# EAGLE design beacon_board (EAGLE 6.5.0)
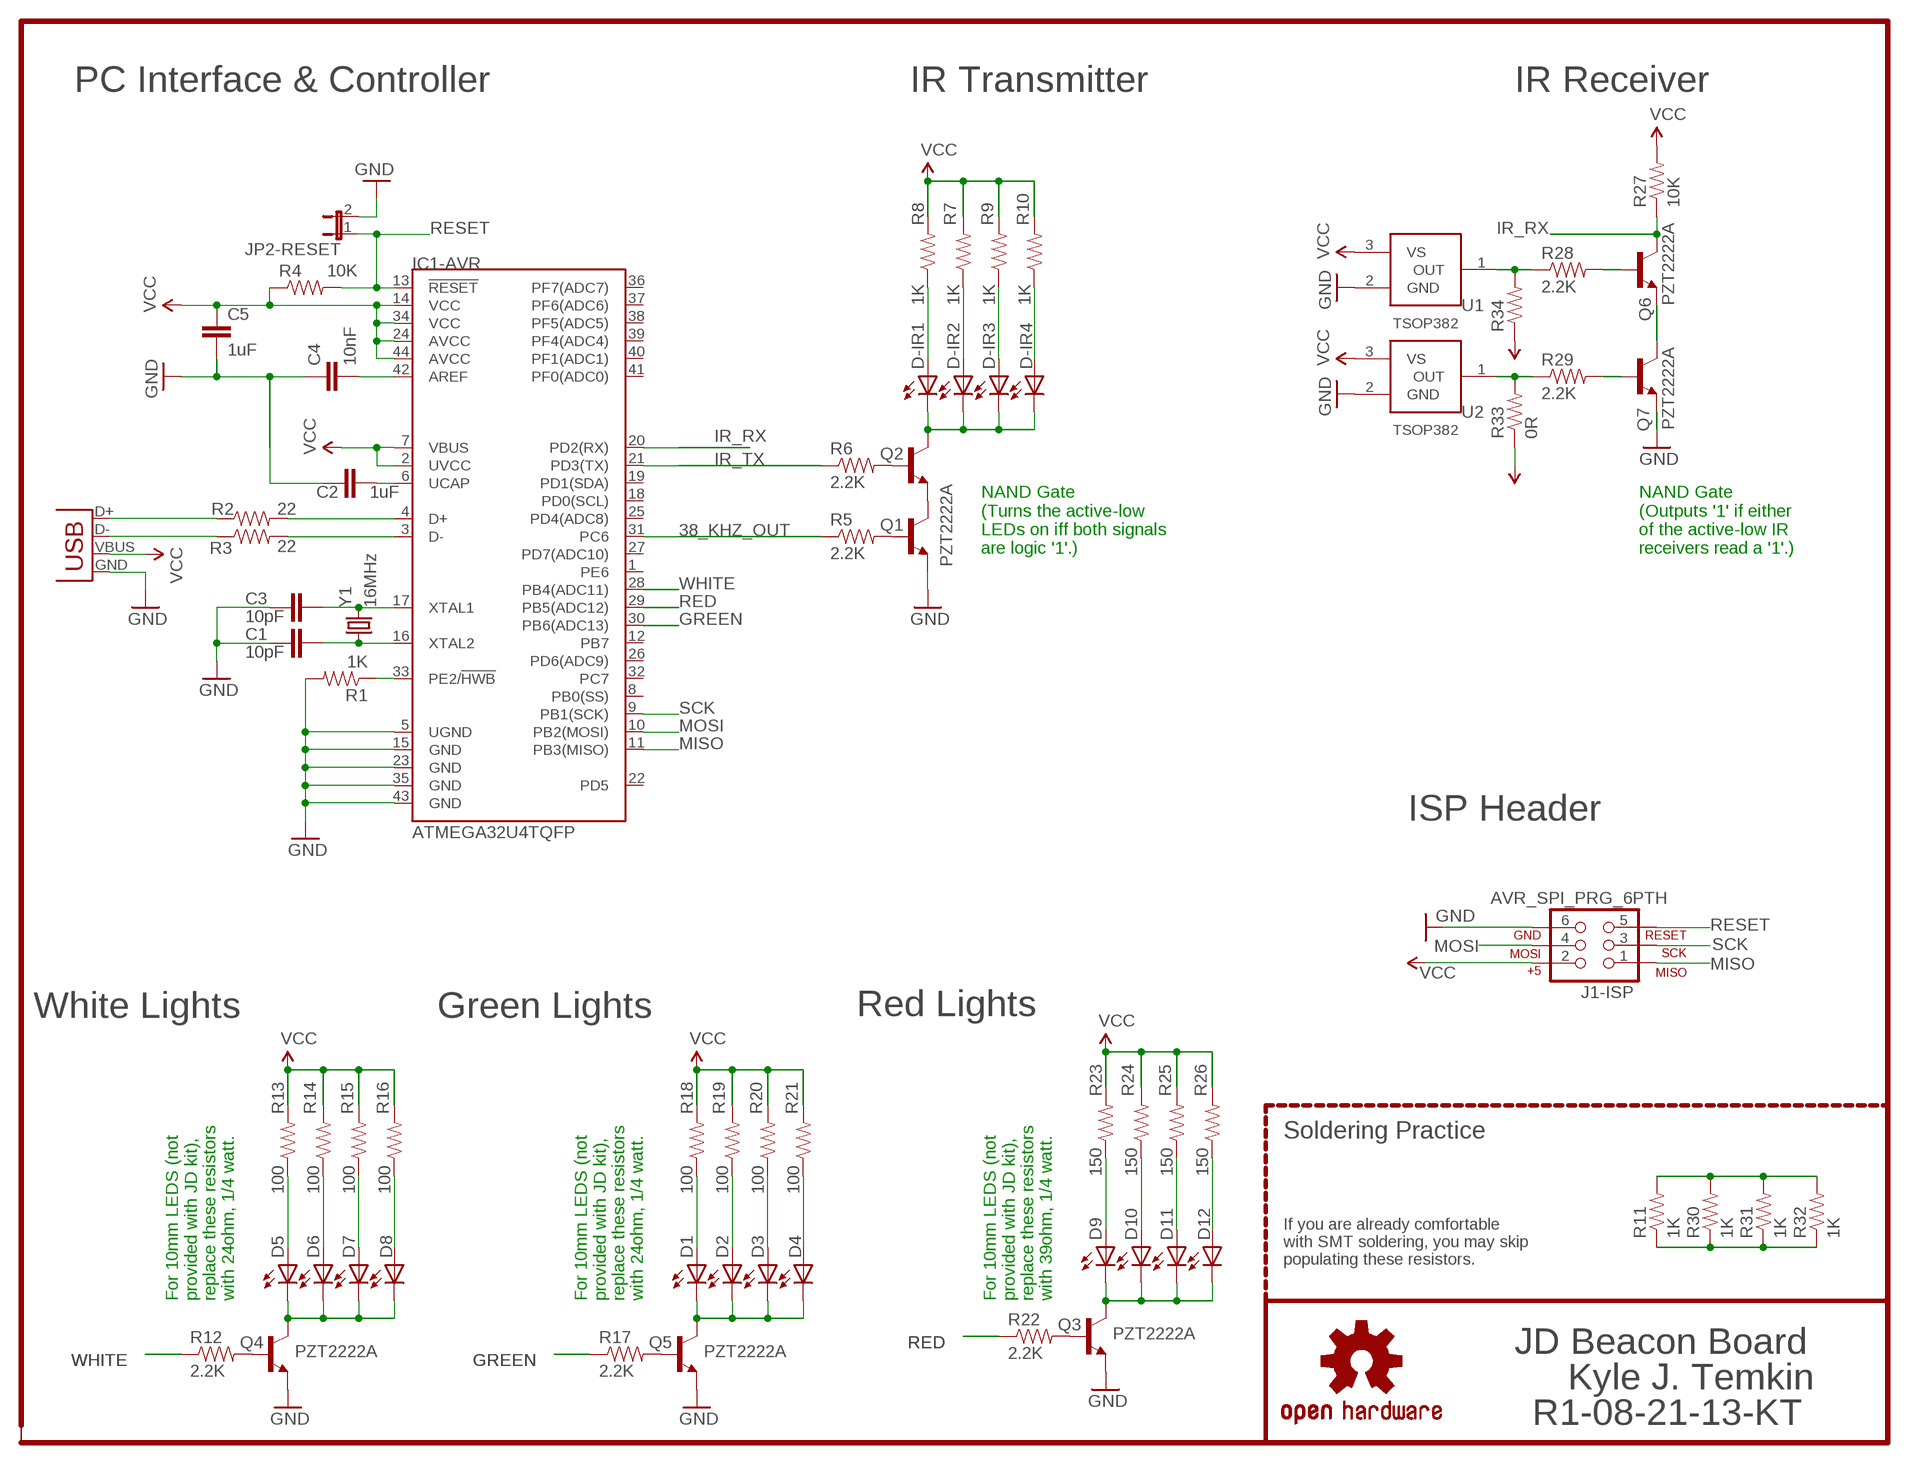
[diagram p0: schematic, sheet 1]

## Parts
C1  10pF  CAP0805  [0805]
C2  1uF  CAP0805  [0805]
C3  10pF  CAP0805  [0805]
C4  10nF  CAP0805  [0805]
C5  1uF  CAP0805  [0805]
D1  LED10MM  [LED10MM]
D2  LED10MM  [LED10MM]
D3  LED10MM  [LED10MM]
D4  LED10MM  [LED10MM]
D5  LED10MM  [LED10MM]
D6  LED10MM  [LED10MM]
D7  LED10MM  [LED10MM]
D8  LED10MM  [LED10MM]
D9  LED10MM  [LED10MM]
D10  LED10MM  [LED10MM]
D11  LED10MM  [LED10MM]
D12  LED10MM  [LED10MM]
D-IR1  LED5MM  [LED5MM]
D-IR2  LED5MM  [LED5MM]
D-IR3  LED5MM  [LED5MM]
D-IR4  LED5MM  [LED5MM]
IC1-AVR  ATMEGA32U4TQFP  [SPARKFUN-DIGITALIC_TQFP44]
J1-ISP  AVR_SPI_PRG_6PTH  [2X3]
JP1  USBSMD  [USB-MINIB]
JP2-RESET  JUMPER-2SMD-NO  [SJ_2S-NO]
LOGO1  OSHW-LOGOM  [OSHW-LOGO-M]
Q1  PZT2222A  [SOT223]
Q2  PZT2222A  [SOT223]
Q3  PZT2222A  [SOT223]
Q4  PZT2222A  [SOT223]
Q5  PZT2222A  [SOT223]
Q6  PZT2222A  [SOT223]
Q7  PZT2222A  [SOT223]
R1  1K  RESISTOR0805-RES  [0805]
R2  22  RESISTOR0805-RES  [0805]
R3  22  RESISTOR0805-RES  [0805]
R4  10K  RESISTOR0805-RES  [0805]
R5  2.2K  RESISTOR0805-RES  [0805]
R6  2.2K  RESISTOR0805-RES  [0805]
R7  1K  RESISTOR0805-RES  [0805]
R8  1K  RESISTOR0805-RES  [0805]
R9  1K  RESISTOR0805-RES  [0805]
R10  1K  RESISTOR0805-RES  [0805]
R11  1K  RESISTOR0805-RES  [0805]
R12  2.2K  RESISTOR0805-RES  [0805]
R13  100  RESISTOR0805-RES  [0805]
R14  100  RESISTOR0805-RES  [0805]
R15  100  RESISTOR0805-RES  [0805]
R16  100  RESISTOR0805-RES  [0805]
R17  2.2K  RESISTOR0805-RES  [0805]
R18  100  RESISTOR0805-RES  [0805]
R19  100  RESISTOR0805-RES  [0805]
R20  100  RESISTOR0805-RES  [0805]
R21  100  RESISTOR0805-RES  [0805]
R22  2.2K  RESISTOR0805-RES  [0805]
R23  150  RESISTOR0805-RES  [0805]
R24  150  RESISTOR0805-RES  [0805]
R25  150  RESISTOR0805-RES  [0805]
R26  150  RESISTOR0805-RES  [0805]
R27  10K  RESISTOR0805-RES  [0805]
R28  2.2K  RESISTOR0805-RES  [0805]
R29  2.2K  RESISTOR0805-RES  [0805]
R30  1K  RESISTOR0805-RES  [0805]
R31  1K  RESISTOR0805-RES  [0805]
R32  1K  RESISTOR0805-RES  [0805]
R33  0R  RESISTOR0805-RES  [0805]
R34  RESISTOR0805-RES  [0805]
U1  TSOP382  [TSOP382]
U2  TSOP382  [TSOP382]
U$1  BINGHAMTON-EECE-TEXT  [BINGHAMTON-EECE-TEXT]
Y1  16MHz  CRYSTALHC49US  [HC49US]

## Nets
38_KHZ_OUT: IC1-AVR.31(PC6) R5.1
D1: D1.C D2.C D3.C D4.C Q5.2(C) Q5.4(C)
D2: D9.C D10.C D11.C D12.C Q3.2(C) Q3.4(C)
D9: D5.C D6.C D7.C D8.C Q4.2(C) Q4.4(C)
GND: C1.1 C2.1 C3.1 C4.1 C5.2 IC1-AVR.5(UGND) IC1-AVR.15(GND) IC1-AVR.23(GND) IC1-AVR.35(GND) IC1-AVR.43(GND) J1-ISP.6 JP1.GND JP2-RESET.2 Q1.3(E) Q3.3(E) Q4.3(E) Q5.3(E) Q7.3(E) R1.2 U1.2(GND) U2.2(GND)
GREEN: IC1-AVR.30(PB6(ADC13)) R17.1
IR_RX: IC1-AVR.20(PD2(RX)) Q6.2(C) Q6.4(C) R27.1
IR_TX: IC1-AVR.21(PD3(TX)) R6.1
MISO: IC1-AVR.11(PB3(MISO)) J1-ISP.1
MOSI: IC1-AVR.10(PB2(MOSI)) J1-ISP.4
N$1: IC1-AVR.4(D+) R2.2
N$2: IC1-AVR.3(D-) R3.2
N$3: JP1.D+ R2.1
N$4: JP1.D- R3.1
N$5: C2.2 IC1-AVR.6(UCAP)
N$6: C3.2 IC1-AVR.17(XTAL1) Y1.2
N$7: C1.2 IC1-AVR.16(XTAL2) Y1.1
N$8: IC1-AVR.33(PE2/!HWB) R1.1
N$9: Q4.1(B) R12.2
N$10: Q5.1(B) R17.2
N$11: C4.2 IC1-AVR.42(AREF)
N$12: Q2.1(B) R6.2
N$13: Q1.1(B) R5.2
N$14: Q1.2(C) Q1.4(C) Q2.3(E)
N$15: D-IR1.K(C) D-IR2.K(C) D-IR3.K(C) D-IR4.K(C) Q2.2(C) Q2.4(C)
N$16: D-IR1.A R8.1
N$17: D1.A R18.1
N$18: D5.A R13.1
N$19: D-IR3.A R9.1
N$20: D7.A R15.1
N$21: D3.A R20.1
N$22: Q3.1(B) R22.2
N$23: D9.A R23.1
N$24: D11.A R25.1
N$25: Q6.3(E) Q7.2(C) Q7.4(C)
N$26: R28.1 R34.2 U1.1(OUT)
N$27: Q6.1(B) R28.2
N$28: Q7.1(B) R29.2
N$29: R29.1 R33.2 U2.1(OUT)
N$30: R11.2 R30.2 R31.2 R32.2
N$31: R11.1 R30.1 R31.1 R32.1
RED: IC1-AVR.29(PB5(ADC12)) R22.1
RESET: IC1-AVR.13(!RESET) J1-ISP.5 JP2-RESET.1 R4.2
SCK: IC1-AVR.9(PB1(SCK)) J1-ISP.3
VCC: C5.1 IC1-AVR.2(UVCC) IC1-AVR.7(VBUS) IC1-AVR.14(VCC) IC1-AVR.24(AVCC) IC1-AVR.34(VCC) IC1-AVR.44(AVCC) J1-ISP.2 JP1.VBUS R4.1 R7.2 R8.2 R9.2 R10.2 R13.2 R14.2 R15.2 R16.2 R18.2 R19.2 R20.2 R21.2 R23.2 R24.2 R25.2 R26.2 R27.2 R33.1 R34.1 U1.3(VS) U2.3(VS)
VCC1: D-IR2.A R7.1
VCC2: D6.A R14.1
VCC3: D-IR4.A R10.1
VCC4: D8.A R16.1
VCC5: D2.A R19.1
VCC6: D4.A R21.1
VCC7: D10.A R24.1
VCC8: D12.A R26.1
WHITE: IC1-AVR.28(PB4(ADC11)) R12.1
Unconnected: IC1-AVR.1(PE6) IC1-AVR.8(PB0(SS)) IC1-AVR.12(PB7) IC1-AVR.18(PD0(SCL)) IC1-AVR.19(PD1(SDA)) IC1-AVR.22(PD5) IC1-AVR.25(PD4(ADC8)) IC1-AVR.26(PD6(ADC9)) IC1-AVR.27(PD7(ADC10)) IC1-AVR.32(PC7) IC1-AVR.36(PF7(ADC7)) IC1-AVR.37(PF6(ADC6)) IC1-AVR.38(PF5(ADC5)) IC1-AVR.39(PF4(ADC4)) IC1-AVR.40(PF1(ADC1)) IC1-AVR.41(PF0(ADC0))

## Notes on the sheet
- PC Interface & Controller | IR Transmitter | IR Receiver
- NAND Gate
  (Turns the active-low
  LEDs on iff both signals 
  are logic '1'.)
- NAND Gate
  (Outputs '1' if either
  of the active-low IR 
  receivers read a '1'.)
- ISP Header
- White Lights | Green Lights | Red Lights
- Soldering Practice
- If you are already comfortable
  with SMT soldering, you may skip
  populating these resistors.
- For 10mm LEDS (not
  provided with JD kit),
  replace these resistors
  with 24ohm, 1/4 watt.
- For 10mm LEDS (not
  provided with JD kit),
  replace these resistors
  with 24ohm, 1/4 watt.
- For 10mm LEDS (not
  provided with JD kit),
  replace these resistors
  with 39ohm, 1/4 watt.
- JD Beacon Board
- Kyle J. Temkin
- R1-08-21-13-KT

## Library data of the parts
C1-C4 = SparkFun-Capacitors:CAP: Capacitor Standard 0603 ceramic capacitor, and 0.1" leaded capacitor.
C5 = SparkFun-Passives:CAP: Capacitor Standard 0603 ceramic capacitor, and 0.1" leaded capacitor.
D1-D12 = beacon_board:LED: LEDs Standard schematic elements and footprints for 5mm, 3mm, 1206, and 0603 sized LEDs. 5mm - Spark Fun Electronics SKU : COM-00529 (and others)
D-IR1-D-IR4 = SparkFun-LED:LED: LEDs Standard schematic elements and footprints for 5mm, 3mm, 1206, and 0603 sized LEDs. 5mm - Spark Fun Electronics SKU : COM-00529 (and others)
IC1-AVR = SparkFun-DigitalIC:ATMEGA32U4: Atmel 44-pin 8-bit Microcontroller with 32KBytes of ISP Flash and USB Controller ----- Please use the QFN-44-NOPAD_1:1 package for the footprint of all boards using a 32U4. Route traces directly away from the pads as much as possible.
J1-ISP = SparkFun-Connectors:AVR_SPI_PRG_6: AVR ISP 6 Pin This is the reduced ISP connector for AVR programming. Common on Arduino. This footprint will take up less PCB space and can be used with a 10-pin to 6-pin adapter such as SKU: BOB-08508
JP1 = SparkFun-Connectors:USB: USB Connectors USB-B-PTH is fully proven SKU : PRT-00139/CONN-08278 USB-miniB is fully proven SKU : PRT-00587 USB-A-PCB is untested. USB-A-H is throughly reviewed, but untested. Spark Fun Electronics SKU : PRT-00437 USB-B-SMT is throughly reviewed, but untested. Needs silkscreen touching up. USB-A-S has not been used/tested USB-MB-H has not been used/tested USB-MICROB has been used. CONN-09505
JP2-RESET = SparkFun-Passives:JUMPER-2: Jumper Basic 0.1" spaced jumper. Use with breakaway headers.
LOGO1 = SparkFun-Aesthetics:OSHW-LOGO: Open Source Hardware Logo This logo indicates the piece of hardware it is found on incorporates a OSHW license and/or adheres to the definition of open source hardware found here: http://freedomdefined.org/OSHW
Q1-Q7 = junior_design:PZT2222A
R1 R4 R11 R30-R32 = SparkFun-Passives:RESISTOR: Resistor Basic schematic elements and footprints for 0603, 1206, and PTH resistors.
R2 R3 R5-R10 R12-R29 R33 R34 = SparkFun-Resistors:RESISTOR: Resistor Basic schematic elements and footprints for 0603, 1206, and PTH resistors.
U1 U2 = beacon_board:TSOP382: Vishay IR receiver module
U$1 = logos:BINGHAMTON-EECE-TEXT: Binghamton University EECE Text Logo (Reccomended!)
Y1 = SparkFun-FreqCtrl:CRYSTAL: Various standard crystals. Proven footprints. Spark Fun Electronics SKU : COM-00534

## Board
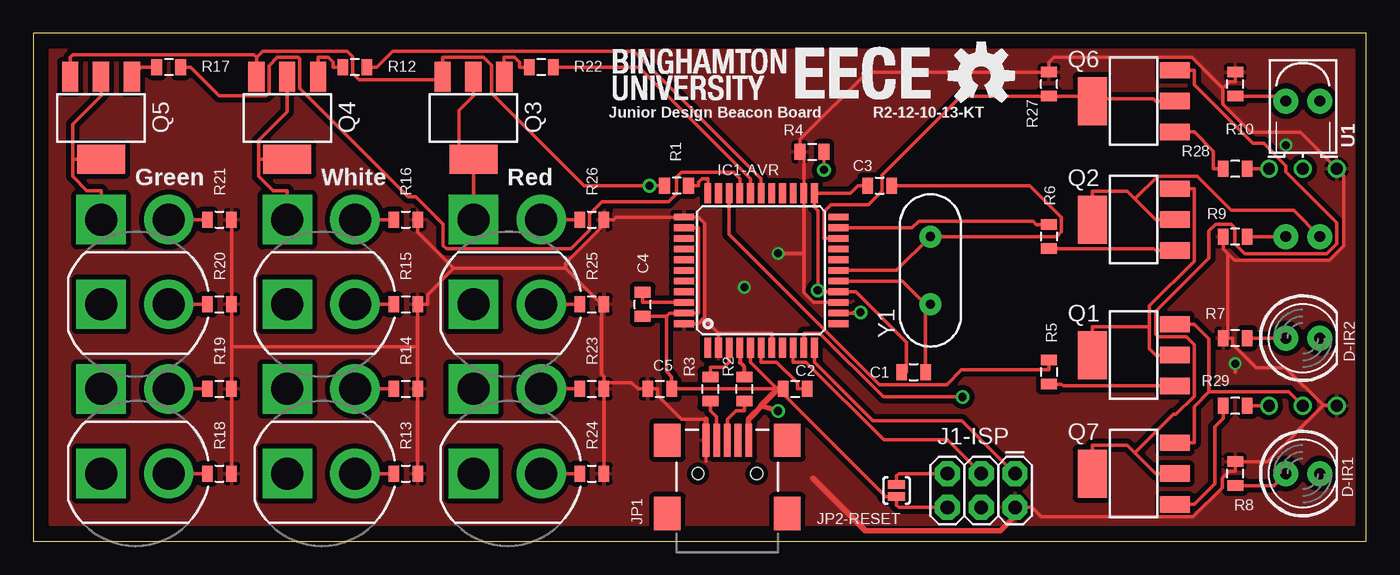
[diagram p1: board, top side]
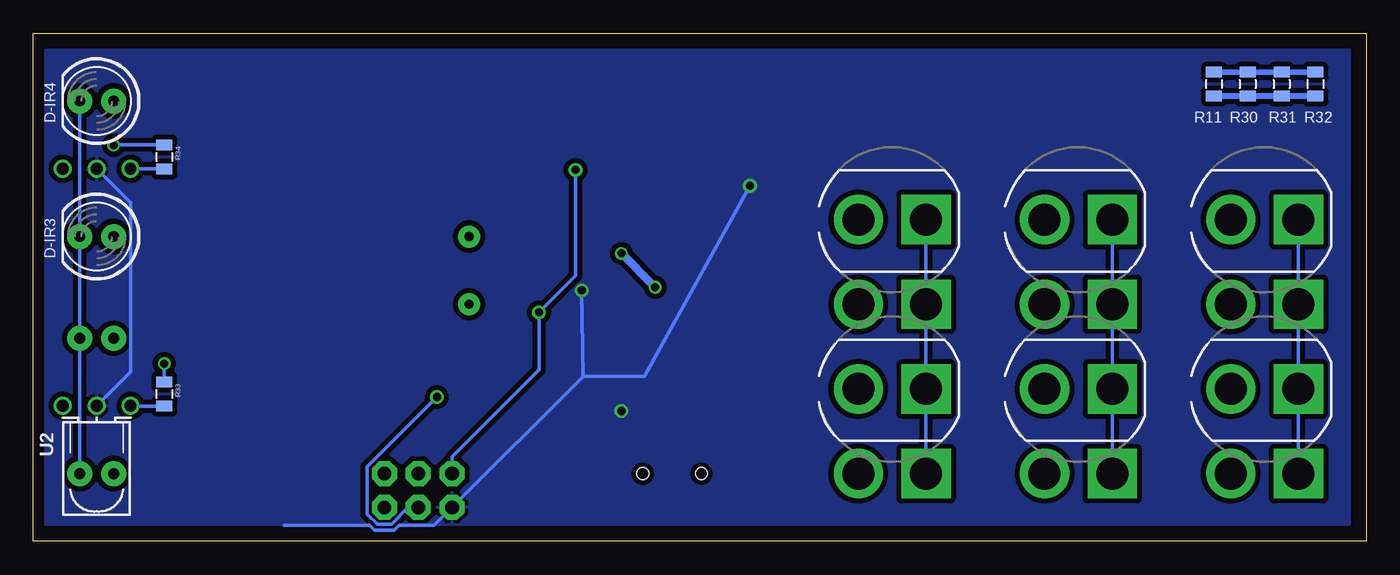
[diagram p2: board, bottom side, seen from below]

Size 100 x 38.1 mm. Coordinates in mm from the lower left corner, seen from the top.
Outline: 0,0 100,0 100,38.1 0,38.1 0,0
Copper layers (1*16): Top 0.0356mm / dielectric 1.5011mm / Bottom 0.0356mm
Design rules "LaenPCBOrder": minimum track width 6mil, minimum drill 13mil, track to track 6mil, track to pad 6mil, pad to pad 6mil, via to via 6mil, smd to smd 6mil, copper to edge 15mil, drill to drill 6mil, minimum pad ring 7mil, minimum via ring 7mil, stop-mask expansion 4mil, vias tented up to drill 0mil, thermal gap 10mil

### Footprints (pad centres in the part's own frame; a part is rotated, then mirrored left to right if it is on the bottom)
0805 = smd 0.8 x 1.2: 1 -0.9,0; 2 0.9,0
LED10MM = drill 2.4 pad 3.7: A 2.54,0 | drill 2.4 pad 3.7 square: C -2.54,0
LED5MM = drill 0.813 pad 1.88: A -1.27,0; K 1.27,0
SPARKFUN-DIGITALIC_TQFP44 = smd 1.5 x 0.5: 1 -5.8,4; 2 -5.8,3.2; 3 -5.8,2.4; 4 -5.8,1.6; 5 -5.8,0.8; 6 -5.8,0; 7 -5.8,-0.8; 8 -5.8,-1.6; 9 -5.8,-2.4; 10 -5.8,-3.2; 11 -5.8,-4; 23 5.8,-4; 24 5.8,-3.2; 25 5.8,-2.4; 26 5.8,-1.6; 27 5.8,-0.8; 28 5.8,0; 29 5.8,0.8; 30 5.8,1.6; 31 5.8,2.4; 32 5.8,3.2; 33 5.8,4 | smd 0.5 x 1.5: 12 -4,-5.8; 13 -3.2,-5.8; 14 -2.4,-5.8; 15 -1.6,-5.8; 16 -0.8,-5.8; 17 0,-5.8; 18 0.8,-5.8; 19 1.6,-5.8; 20 2.4,-5.8; 21 3.2,-5.8; 22 4,-5.8; 34 4,5.8; 35 3.2,5.8; 36 2.4,5.8; 37 1.6,5.8; 38 0.8,5.8; 39 0,5.8; 40 -0.8,5.8; 41 -1.6,5.8; 42 -2.4,5.8; 43 -3.2,5.8; 44 -4,5.8
2X3 = drill 1.016 pad 1.88 octagon: 1 0,0; 2 0,2.54; 3 2.54,0; 4 2.54,2.54; 5 5.08,0; 6 5.08,2.54
USB-MINIB = smd 2.5 x 0.5: D+ 2.5,0; D- 2.5,0.8; GND 2.5,-1.6; ID 2.5,-0.8; VBUS 2.5,1.6 | smd 2.5 x 2: MTN1 -3,4.5; MTN2 2.5,4.5; MTN3 -3,-4.5; MTN4 2.5,-4.5 | hole 0.9: 0,2.2; 0,-2.2
SJ_2S-NO = smd 0.635 x 1.27: 1 -0.45,0; 2 0.45,0
SOT223 = smd 1.219 x 2.235: 1 -2.311,-3.099; 2 0,-3.099; 3 2.311,-3.099 | smd 3.6 x 2.2: 4 0,3.099
TSOP382 = drill 0.889: 1 -2.54,0; 2 0,0; 3 2.54,0
HC49US = drill 0.7 pad 1.651: 1 -2.54,0; 2 2.54,0

### Placement (x,y rotation side)
C1  66.04,12.7 0 top
C2  57.15,11.43 0 top
C3  63.5,26.67 0 top
C4  45.72,17.78 90 top
C5  46.99,11.43 0 top
D1  7.62,5.08 0 top
D2  7.62,11.43 180 bottom
D3  7.62,17.78 0 top
D4  7.62,24.13 180 bottom
D5  21.59,5.08 0 top
D6  21.59,11.43 180 bottom
D7  21.59,17.78 0 top
D8  21.59,24.13 180 bottom
D9  35.56,11.43 180 bottom
D10  35.56,5.08 0 top
D11  35.56,17.78 0 top
D12  35.56,24.13 180 bottom
D-IR1  95.25,5.08 0 top
D-IR2  95.25,15.24 0 top
D-IR3  95.25,22.86 180 bottom
D-IR4  95.25,33.02 180 bottom
IC1-AVR  54.61,20.32 90 top
J1-ISP  73.66,5.08 180 top
JP1  52.07,5.08 90 top
JP2-RESET  64.77,3.81 270 top
LOGO1  71.12,34.92 0 top
Q1  82.55,13.97 90 top
Q2  82.55,24.13 90 top
Q3  33.02,31.75 180 top
Q4  19.05,31.75 180 top
Q5  5.08,31.75 180 top
Q6  82.55,33.02 90 top
Q7  82.55,5.08 90 top
R1  48.26,26.67 180 top
R2  53.34,11.43 90 top
R3  50.8,11.43 90 top
R4  58.42,29.21 0 top
R5  76.2,12.7 270 top
R6  76.2,22.86 270 top
R7  90.17,15.24 180 top
R8  90.17,5.08 90 top
R9  90.17,22.86 180 top
R10  90.17,34.29 90 top
R11  11.43,34.29 270 bottom
R12  24.13,35.56 180 top
R13  27.94,5.08 0 top
R14  27.94,11.43 0 top
R15  27.94,17.78 0 top
R16  27.94,24.13 0 top
R17  10.16,35.56 180 top
R18  13.97,5.08 0 top
R19  13.97,11.43 0 top
R20  13.97,17.78 0 top
R21  13.97,24.13 0 top
R22  38.1,35.56 180 top
R23  41.91,11.43 0 top
R24  41.91,5.08 0 top
R25  41.91,17.78 0 top
R26  41.91,24.13 0 top
R27  76.2,34.29 90 top
R28  90.17,27.94 180 top
R29  90.17,10.16 180 top
R30  8.89,34.29 270 bottom
R31  6.35,34.29 270 bottom
R32  3.81,34.29 270 bottom
R33  90.17,11.05 270 bottom
R34  90.17,28.83 270 bottom
U1  95.25,27.94 0 top
U2  95.25,10.16 180 bottom
U$1  42.55,32.77 0 top
Y1  67.31,20.32 90 top

### Tracks (layer width: path | path; a pad name or v marks a point on that pad's centre or on a via)
38_KHZ_OUT
  Top 0.254: IC1-AVR.31 52.21,23.03 63.49,11.76 68.53,11.76 69.65,12.87 76.2,12.87 R5.1
D1
  Top 0.254: Q5.2 5.08,33.4 2.95,31.27 2.95,28.65 | D4.C 5.08,26.31 4.01,26.31 2.95,27.38 2.95,28.65 | Q5.4 2.95,28.65
  Bottom 0.254: D1.C D2.C D3.C D4.C
D2
  Top 0.254: 32.48,28.65 33.02,28.11 D12.C | Q3.2 33.02,33.4 31.94,32.32 31.94,28.65
  Top 0.305: 31.94,28.65 32.48,28.65 Q3.4
  Bottom 0.254: D12.C D11.C D9.C D10.C
D9
  Top 0.254: Q4.2 19.05,32.21 16.92,30.08 16.92,28.65 | D8.C 19.05,26.31 17.98,26.31 16.92,27.38 16.92,28.65 | Q4.4 16.92,28.65
  Bottom 0.254: D5.C D6.C D7.C D8.C
GND  (via drill 0.61 pad 1.02)
  Top 0.254: J1-ISP.6 64.94,2.54 64.77,2.71 JP2-RESET.2 63.8,3.36 63.8,3.51 55.88,11.43 C2.1 | C3.1 61.87,26.67 61.32,26.12 IC1-AVR.23 58.61,25.04 58.85,24.8 v58.85,18.82 59.23,18.82 59.33,18.72 IC1-AVR.15 60.95,18.72 61.49,18.72 61.72,18.72 65.5,14.94 65.5,12.7 C1.1 | 16.74,36.3 17.2,36.76 23.55,36.76 23.96,36.35 23.96,35.12 24.45,34.63 30.71,34.63 Q3.3 30.71,36.3 33.78,36.3 34.39,35.69 34.39,33.59 41.32,26.67 v46.23,26.67 46.99,26.67 R1.2 | 16.74,36.3 16.55,36.49 2.96,36.49 2.77,36.3 Q5.3 | Q4.3 16.74,36.3 | Q1.3 87.1,16.28 88.19,15.18 88.19,11.2 | 88.19,11.2 94.21,11.2 U2.2 | 88.19,11.2 87.1,10.11 87.1,7.39 Q7.3 | 54.61,10.16 55.79,11.43 | 55.79,11.43 55.52,11.43 | 55.79,11.43 55.52,11.43 | 55.52,11.43 48.62,11.43 C5.2 47.89,12.36 47.49,12.76 47.49,16.88 | 47.49,16.88 47.73,17.12 48.27,17.12 IC1-AVR.43 49.89,17.12 49.89,23.52 IC1-AVR.35 | 47.49,16.88 46.65,16.88 C4.1 | 55.79,11.43 54.27,12.98 53.81,13.44 IC1-AVR.5 | 55.79,11.43 55.52,11.43
  Top 0.406: 55.88,11.43 54.61,10.16 v55.88,9.78 | 55.79,11.43 54.27,9.76 53.67,9.16 JP1.GND
  Bottom 0.254: 58.77,12.39 54.16,12.39 v46.23,26.67 | 58.77,12.39 58.77,12.35 J1-ISP.6 69.92,1.2 72.56,1.2 72.94,0.81 74.38,0.81 74.76,1.2 81.19,1.2 | 58.77,12.39 v58.85,18.82 | U2.2 92.7,12.71 92.7,25.39 U1.2
  pour Bottom (isolate 0.381): 1.27,36.83 1.27,1.27 99.06,1.27 99.06,36.83
GREEN
  Top 0.254: IC1-AVR.30 53.01,27.2 52.53,27.68 48.63,27.68 48.26,27.3 48.26,26.07 47.67,25.48 42.67,25.48 41.74,24.54 41.74,23.32 40.34,21.93 30.99,21.93 30.74,22.18 30.74,23.78 28.66,25.85 28.12,25.85 19.99,33.98 19.99,36.19 19.88,36.3 18.3,36.3 17.68,35.68 17.68,33.59 17.48,33.4 13.95,33.4 11.79,35.56 R17.1
IR_RX
  Top 0.254: 79.45,33.2 79.27,33.39 R27.1 69.6,33.39 63.67,27.46 63.67,26.25 62.66,25.24 59.85,25.24 59.33,24.72 59.33,22.72 IC1-AVR.20 | Q6.2 84.2,33.02 84.02,33.2 79.45,33.2 | Q6.4 79.45,33.2
IR_TX
  Top 0.254: R6.1 75.27,23.76 75.01,24.02 66.43,24.02 65.93,23.52 IC1-AVR.21
MISO
  Top 0.254: IC1-AVR.11 58.61,13.44 62.99,9.05 69.69,9.05 J1-ISP.1
MOSI  (via drill 0.61 pad 1.02)
  Top 0.254: v69.72,10.83 63.77,10.83 59,15.6 57.81,15.6 IC1-AVR.10
  Bottom 0.254: J1-ISP.4 71.86,2.54 | 71.86,2.54 | 71.86,2.54 73.13,1.27 74.19,1.27 74.96,2.04 74.96,5.59 v69.72,10.83
N$1
  Top 0.305: IC1-AVR.4 53.01,13.41 53.34,13.09 R2.2
N$2
  Top 0.254: IC1-AVR.3 52.21,13.44 51.83,13.06 50.8,13.06 R3.2
N$3
  Top 0.254: JP1.D+ 52.07,9.16 52.71,9.8 53.34,9.8 R2.1
N$4
  Top 0.254: R3.1 50.8,9.8 51.27,9.33 JP1.D-
N$5
  Top 0.254: C2.2 57.32,11.43 57.32,11.89 55.77,13.44 54.61,13.44 IC1-AVR.6
N$6
  Top 0.254: C3.2 74.78,26.67 77.13,24.32 77.13,23.21 76.78,22.86 Y1.2 64.77,20.32 IC1-AVR.17
N$7
  Top 0.254: 66.94,17.78 65.2,19.52 IC1-AVR.16 | Y1.1 66.94,17.78 | 66.94,17.78 66.94,13.63 C1.2
N$8
  Top 0.254: R1.1 49.89,26.67 49.89,26.93 50.16,27.2 50.61,27.2 IC1-AVR.33
N$9
  Top 0.254: R12.2 22.5,35.56 22.5,35.92 22.13,36.3 21.36,36.3 Q4.1
N$10
  Top 0.254: R17.2 8.1,35.56 Q5.1
N$11
  Top 0.254: C4.2 45.72,17.95 45.75,17.92 IC1-AVR.42
N$12
  Top 0.254: Q2.1 84.2,21.82 84.06,21.96 R6.2
N$13
  Top 0.254: R5.2 77.13,11.8 77.27,11.66 84.2,11.66 Q1.1
N$14
  Top 0.254: 83.74,16.1 83.74,14.43 84.2,13.97 Q1.2 | 83.74,16.1 83.74,17.66 87.1,21.01 87.1,26.44 Q2.3 | 83.74,16.1 79.45,16.1 Q1.4
N$15
  Top 0.254: 82.65,25.68 84.2,24.13 Q2.2 | 82.65,25.68 82.07,26.26 79.45,26.26 Q2.4 | 82.65,25.68 84.36,27.38 87.34,27.38 89.89,24.83 94.55,24.83 D-IR3.K
  Bottom 0.254: D-IR4.K D-IR3.K D-IR2.K D-IR1.K
N$16
  Top 0.254: R8.1 93.08,4.18 D-IR1.A
N$17
  Top 0.254: R18.1 D1.A
N$18
  Top 0.254: R13.1 D5.A
N$19
  Top 0.254: R9.1 D-IR3.A
N$20
  Top 0.254: R15.1 D7.A
N$21
  Top 0.254: R20.1 D3.A
N$22
  Top 0.254: R22.2 36.47,35.56 36.47,35.92 36.1,36.3 35.33,36.3 Q3.1
N$23
  Top 0.254: R23.1 D9.A
N$24
  Top 0.254: R25.1 D11.A
N$25
  Top 0.254: 82.65,6.63 84.2,5.08 Q7.2 | 82.65,6.63 82.07,7.21 79.45,7.21 Q7.4 | 82.65,6.63 85.54,9.53 85.73,9.53 87.1,10.89 87.1,14.75 86.51,15.34 84.39,15.34 84.2,15.54 84.2,17.24 88.21,21.25 88.21,23.29 88.71,23.79 89.87,23.79 90.13,23.54 90.13,22.32 90.89,21.55 97.04,21.55 97.8,22.32 97.8,23.9 93.98,27.73 93.98,28.18 92.31,29.85 91.5,29.85 87.1,34.25 87.1,35.33 Q6.3
N$26
  Top 0.254: U1.1 R28.1
  Bottom 0.254: R34.2 92.71,27.93 U1.1
N$27
  Top 0.254: R28.2 88.54,27.94 88.54,29.27 87.1,30.71 Q6.1
N$28
  Top 0.254: Q7.1 87.1,2.77 88.64,4.32 88.64,8.6 89.27,9.23 R29.2
N$29
  Top 0.254: U2.1 R29.1
  Bottom 0.254: R33.2 92.71,10.15 U2.1
N$30
  Bottom 0.406: R30.2 R11.2 3.68,33.4 11.43,33.4 R30.2 | R30.2 R31.2 | R31.2 R32.2 | R31.2 R30.2
N$31
  Bottom 0.406: R32.1 R31.1 | R31.1 R30.1 | R30.1 R11.1 | R31.1 R30.1 | R30.1 R11.1 | R11.1 R30.1
RED
  Top 0.254: R22.1 45.45,35.56 53.81,27.2 IC1-AVR.29
RESET  (via drill 0.61 pad 1.02)
  Top 0.254: v62.06,17.17 61.54,17.17 61.49,17.12 IC1-AVR.13 | v59.32,27.86 59.32,28.28 R4.2 | JP2-RESET.1 64.77,4.91 64.94,5.08 J1-ISP.5
  Bottom 0.254: v59.32,27.86 59.32,19.91 v62.06,17.17 62.06,12.87 68.58,6.35 J1-ISP.5
SCK
  Top 0.254: IC1-AVR.9 57.01,13.44 57.96,13.44 63.8,7.6 68.6,7.6 J1-ISP.3
VCC  (via drill 0.6)
  Top 0.254: 89.64,21.55 90.09,21.1 97.23,21.1 98.31,22.18 98.31,27.42 U1.3 95.07,30.66 91.36,30.66 89.23,32.79 89.23,33.98 | 89.23,33.98 89.71,34.46 90.17,34.46 R10.2 | 89.23,33.98 86.92,36.3 76.58,36.3 76.2,35.92 R27.2 62.57,35.19 57.52,30.14 57.52,29.68 | IC1-AVR.14 58.53,17.92 57.81,18.64 IC1-AVR.24 57.81,29.39 57.52,29.68 | R4.1 57.52,29.68 | 50.29,16.72 49.89,16.32 IC1-AVR.44 | 50.29,16.72 50.35,16.78 50.35,23.86 49.89,24.32 IC1-AVR.34 43.73,24.32 43.54,24.13 43.2,24.13 | 50.29,16.72 51.41,15.6 | IC1-AVR.7 55.41,15.6 51.41,15.6 | IC1-AVR.2 51.41,15.6 | JP1.VBUS 50.47,6 | 74.3,2.54 74.93,2.54 75.64,1.83 86.98,1.83 89.19,4.04 89.19,4.73 89.71,5.25 90.17,5.25 R8.2 92.56,5.98 96.77,10.19 | R9.2 89.27,21.92 89.64,21.55 | 89.64,15.24 89.64,21.55 | 89.64,15.24 90,15.24 90,14.78 91.77,13.01 93.95,13.01 96.77,10.19 | R7.2 89.64,15.24 | 42.81,11.89 44.9,11.89 45.36,11.43 C5.1 46.82,11.43 46.82,10.97 48.63,9.16 50.47,9.16 | 42.81,11.89 42.81,12.36 42.63,12.54 42.63,17.78 | 42.81,11.89 R23.2 R24.2 | 42.63,17.78 39.92,20.49 | 39.92,20.49 31.55,20.49 | 43.2,24.13 39.92,20.85 39.92,20.49 | R25.2 42.63,17.78 | 31.55,20.49 29.57,18.51 29.57,17.78 R15.2 28.84,14.61 | 31.55,20.49 28.84,23.2 R16.2 | R26.2 43.2,24.13 | U2.3 97.76,10.19 96.77,10.19 | R13.2 R14.2 28.84,14.61 | R18.2 R19.2 14.87,14.61 | 14.87,14.61 R20.2 R21.2 | 28.84,14.61 14.87,14.61 | v90.17,13.34 90.17,12.7
  Top 0.305: v55.88,21.59 57.66,21.59
  Top 0.406: 58.49,4.73 62.44,0.79 72.54,0.79 74.3,2.54 J1-ISP.2 | JP1.VBUS 50.47,9.16
  Bottom 0.254: R33.1 v90.17,13.34 | R34.1 93.97,29.73 v93.98,29.72
  Bottom 0.61: v53.34,19.05 v55.88,21.59
  pour Top (isolate 0.381): 1.27,36.83 1.27,1.27 99.06,1.27 99.06,36.83 2.54,36.83
VCC1
  Top 0.254: R7.1 D-IR2.A
VCC2
  Top 0.254: R14.1 D6.A
VCC3
  Top 0.254: R10.1 93.61,33.39 D-IR4.A
VCC4
  Top 0.254: R16.1 D8.A
VCC5
  Top 0.254: R19.1 D2.A
VCC6
  Top 0.254: R21.1 D4.A
VCC7
  Top 0.254: R24.1 D10.A
VCC8
  Top 0.254: R26.1 D12.A
WHITE
  Top 0.254: IC1-AVR.28 54.61,27.2 45.05,36.76 26.96,36.76 25.76,35.56 R12.1

### Text on the board
tPlace: Junior Design Beacon Board | R2-12-10-13-KT
tNames: Green | White | Red